# EAGLE schematic SuperSensors (EAGLE 7.1.0)
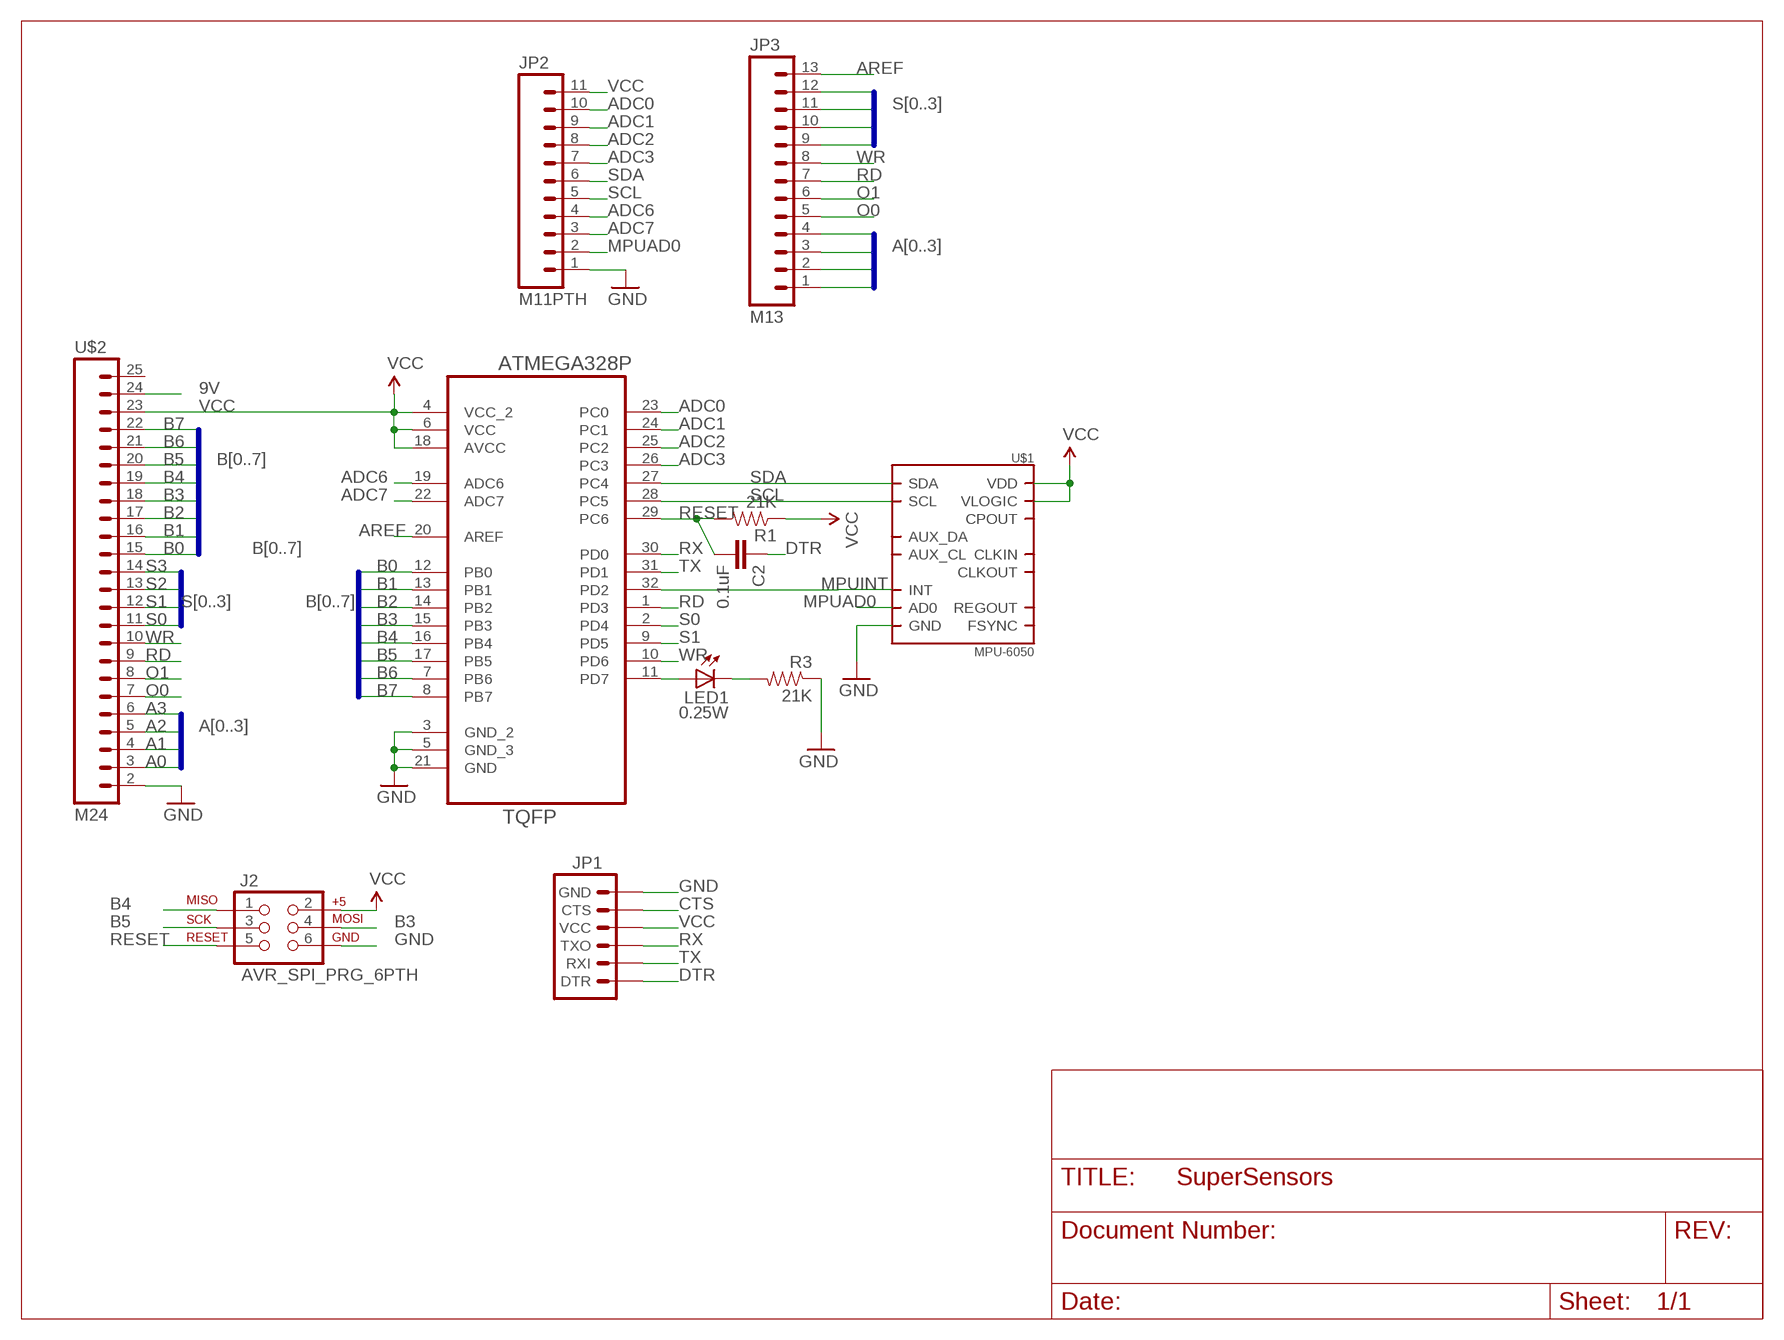
[diagram p0: schematic, sheet 1]

## Parts
C2  0.1uF  CAPPTH  [CAP-PTH-SMALL]
J2  AVR_SPI_PRG_6PTH  [2X3]
JP1  ARDUINO_SERIAL_PROGRAMPTH  [1X06]
JP2  M11PTH  [1X11]
JP3  M13  [1X13]
LED1  0.25W  LED5MM  [LED5MM]
R1  21K  RESISTORPTH-1/4W  [AXIAL-0.4]
R3  21K  RESISTORPTH-1/4W  [AXIAL-0.4]
U1  ATMEGA328P-AU  [QFP80P900X900X120-32N]
U$1  MPU-6050  [QFN.24.4X4]
U$2  M24  [1X24]

## Nets
9V: U$2.24
A0: JP3.1 U$2.3
A1: JP3.2 U$2.4
A2: JP3.3 U$2.5
A3: JP3.4 U$2.6
ADC0: JP2.10 U1.23(PC0)
ADC1: JP2.9 U1.24(PC1)
ADC2: JP2.8 U1.25(PC2)
ADC3: JP2.7 U1.26(PC3)
ADC6: JP2.4 U1.19(ADC6)
ADC7: JP2.3 U1.22(ADC7)
AREF: JP3.13 U1.20(AREF)
B0: U1.12(PB0) U$2.15
B1: U1.13(PB1) U$2.16
B2: U1.14(PB2) U$2.17
B3: J2.4 U1.15(PB3) U$2.18
B4: J2.1 U1.16(PB4) U$2.19
B5: J2.3 U1.17(PB5) U$2.20
B6: U1.7(PB6) U$2.21
B7: U1.8(PB7) U$2.22
CTS: JP1.5(CTS)
DTR: C2.1 JP1.1(DTR)
GND: J2.6 JP1.6(GND) JP2.1 R3.P$1 U1.3(GND_2) U1.5(GND_3) U1.21(GND) U$1.18(GND) U$2.2
MPUAD0: JP2.2 U$1.9(AD0)
MPUINT: U1.32(PD2) U$1.12(INT)
N$1: LED1.A U1.11(PD7)
N$5: LED1.K(C) R3.P$2
O0: JP3.5 U$2.7
O1: JP3.6 U$2.8
RD: JP3.7 U1.1(PD3) U$2.9
RESET: C2.2 J2.5 R1.P$2 U1.29(PC6)
RX: JP1.3(TXO) U1.30(PD0)
S0: JP3.9 U1.2(PD4) U$2.11
S1: JP3.10 U1.9(PD5) U$2.12
S2: JP3.11 U$2.13
S3: JP3.12 U$2.14
SCL: JP2.5 U1.28(PC5) U$1.23(SCL)
SDA: JP2.6 U1.27(PC4) U$1.24(SDA)
TX: JP1.2(RXI) U1.31(PD1)
VCC: J2.2 JP1.4(VCC) JP2.11 R1.P$1 U1.4(VCC_2) U1.6(VCC) U1.18(AVCC) U$1.8(VLOGIC) U$1.13(VDD) U$2.23
WR: JP3.8 U1.10(PD6) U$2.10
Unconnected: U$1.1(CLKIN) U$1.6(AUX_DA) U$1.7(AUX_CL) U$1.10(REGOUT) U$1.11(FSYNC) U$1.20(CPOUT) U$1.22(CLKOUT) U$2.25

## Buses
B[0..7]
S[0..3]
A[0..3]

## Library data of the parts
C2 = SparkFun-Capacitors:CAP: Capacitor Standard 0603 ceramic capacitor, and 0.1" leaded capacitor.
J2 = SparkFun-Connectors:AVR_SPI_PRG_6: AVR ISP 6 Pin This is the reduced ISP connector for AVR programming. Common on Arduino. This footprint will take up less PCB space and can be used with a 10-pin to 6-pin adapter such as SKU: BOB-08508
JP1 = SparkFun-Connectors:ARDUINO_SERIAL_PROGRAM: FTDI connector footprints
JP2 = SparkFun-Connectors:M11: Header 11 Standard 11-pin 0.1" header. Use with straight break away headers (SKU : PRT-00116), right angle break away headers (PRT-00553), swiss pins (PRT-00743), machine pins (PRT-00117), and female headers (PRT-00115).
JP3 = SparkFun-Connectors:M13: 13-pin single row .1" header
LED1 = SparkFun-LED:LED: LEDs Standard schematic elements and footprints for 5mm, 3mm, 1206, and 0603 sized LEDs. 5mm - Spark Fun Electronics SKU : COM-00529 (and others)
R1 R3 = SparkFun-Passives:RESISTOR: Resistor Basic schematic elements and footprints for 0603, 1206, and PTH resistors.
U1 = Ava:ATMEGA328P-AU; DESCRIPTION: 8-bit Microcontroller with In-System Programmable Flash; MPN: ATMEGA328P-AU; OC_FARNELL: 1715486; OC_NEWARK: 14R4631; PACKAGE: TQFP-32; SUPPLIER: Atmel
U$1 = invensense:MPU-6050
U$2 = SparkFun-Connectors:M24: 1x24 .1" header